# EAGLE design 3D-tracker (EAGLE 9.0.1)
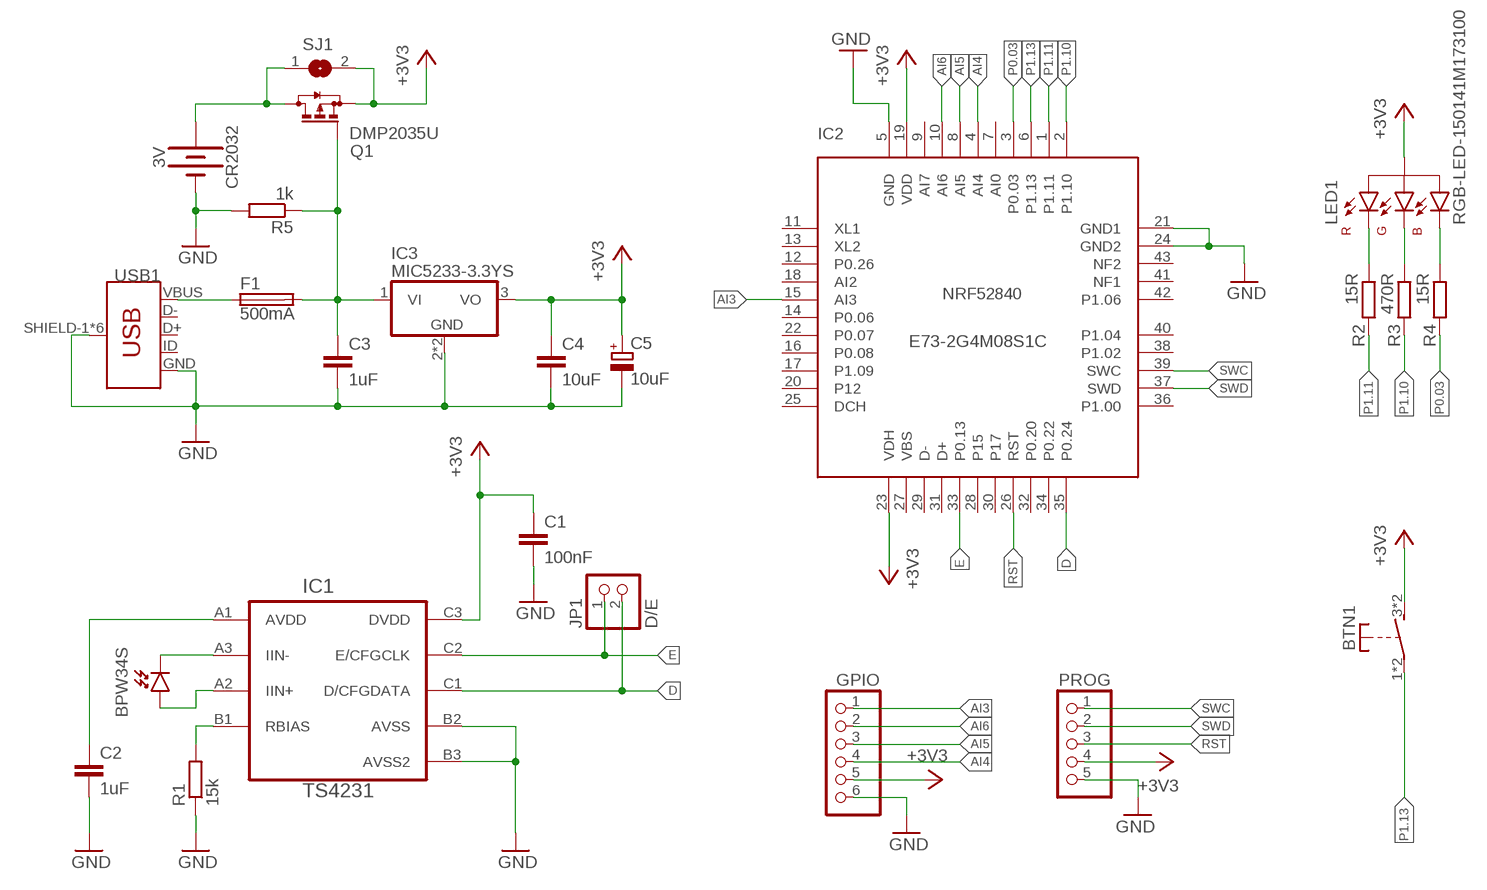
[diagram p0: schematic, sheet 1]

## Parts
BPW34S  JONNEW_PHOTODIODE_VBPW34S  [JONNEW_VBPW34S]
BTN1  SWITCH-SMD  [SWITCH-SMD]
C1  100nF  C-EUC0805  [C0805]
C2  1uF  C-EUC0805  [C0805]
C3  1uF  C-EUC0805  [C0805]
C4  10uF  C-EUC0805  [C0805]
C5  10uF  CPOL-EUE2-5  [E2-5]
CR2032  3V  CR2032-HOLDER  [BATTCON_20MM]
F1  500mA  FUSE-SMD  [R1206]
GPIO  PINHD-1X6  [1X06]
IC1  TS4231  JONNEW_TS4231  [JONNEW_WLCSP3X3]
IC2  NRF52840  E73-2G4M08S1C  [PE73(2G4M08S1C)]
IC3  MIC5233-3.3YS  MIC5233  [SOT223]
JP1  D/E  PINHD-1X2  [1X02]
LED1  RGB-LED-150141M173100  [LED4-3.5X2.8]
PROG  PINHD-1X5  [1X05]
Q1  DMP2035U  BSS84  [SOT23]
R1  15k  R-EU_R0805  [R0805]
R2  15R  R-EU_R0805  [R0805]
R3  470R  R-EU_R0805  [R0805]
R4  15R  R-EU_R0805  [R0805]
R5  1k  R-EU_R0805  [R0805]
SJ1  SJ  [SJ]
USB1  USB-B-MICRO-SMD  [MICRO-USB-B-SMD]

## Nets
+3V: CR2032.1(+) CR2032.3(+) Q1.3(D) SJ1.1
+3V3: BTN1.3(S) BTN1.4(S) C1.1 C4.1 C5.+ GPIO.5 IC1.C3(DVDD) IC2.19(VDD) IC2.23(VDH) IC3.3(VO) LED1.1(ALL-A) PROG.4 Q1.2(S) SJ1.2
+5V: C3.1 F1.2 IC3.1(VI) Q1.1(G) R5.1
AI3: GPIO.1 IC2.15(AI3)
AI4: GPIO.4 IC2.4(AI4)
AI5: GPIO.3 IC2.8(AI5)
AI6: GPIO.2 IC2.10(AI6)
AVDD: C2.1 IC1.A1(AVDD)
D: IC1.C1(D/CFGDATA) IC2.35(P0.24) JP1.2
E: IC1.C2(E/CFGCLK) IC2.33(P0.13) JP1.1
GND: C1.2 C2.2 C3.2 C4.2 C5.- CR2032.2(-) GPIO.6 IC1.B2(AVSS) IC1.B3(AVSS2) IC2.5(GND) IC2.21(GND1) IC2.24(GND2) IC3.2(GND) IC3.4(GND) PROG.5 R1.1 R5.2 USB1.GND USB1.SHIELD-1(SHIELD) USB1.SHIELD-2(SHIELD) USB1.SHIELD-3(SHIELD) USB1.SHIELD-4(SHIELD) USB1.SHIELD-5(SHIELD) USB1.SHIELD-6(SHIELD)
IIN+: BPW34S.A IC1.A2(IIN+)
IIN-: BPW34S.C IC1.A3(IIN-)
N$15: LED1.2(BLUE-C) R4.1
N$16: LED1.3(RED-C) R2.1
N$17: LED1.4(GREEN-C) R3.1
P0.03: IC2.3(P0.03) R4.2
P1.10: IC2.2(P1.10) R3.2
P1.11: IC2.1(P1.11) R2.2
P1.13: BTN1.1(P) BTN1.2(P) IC2.6(P1.13)
RBIAS: IC1.B1(RBIAS) R1.2
RST: IC2.26(RST) PROG.3
SWC: IC2.39(SWC) PROG.1
SWD: IC2.37(SWD) PROG.2
VBUS: F1.1 USB1.VBUS
Unconnected: IC2.7(AI0) IC2.9(AI7) IC2.11(XL1) IC2.12(P0.26) IC2.13(XL2) IC2.14(P0.06) IC2.16(P0.08) IC2.17(P1.09) IC2.18(AI2) IC2.20(P12) IC2.22(P0.07) IC2.25(DCH) IC2.27(VBS) IC2.28(P15) IC2.29(D-) IC2.30(P17) IC2.31(D+) IC2.32(P0.20) IC2.34(P0.22) IC2.36(P1.00) IC2.38(P1.02) IC2.40(P1.04) IC2.41(NF1) IC2.42(P1.06) IC2.43(NF2) USB1.D+ USB1.D- USB1.ID

## Notes on the sheet
- E73-2G4M08S1C

## Library data of the parts
BPW34S = ts4231-breakout-module:JONNEW_PHOTODIODE
BTN1 = Marw:SWITCH-SMD: KMR731NG LFS Taktilní Spínač - Farnell <https://cz.farnell.com/c-k-components/kmr731ng-lfs/tactile-sw-spst-no-0-05a-32vdc/dp/2845722>
C1-C4 = resistor:C-EU: CAPACITOR, European symbol
C5 = resistor:CPOL-EU: POLARIZED CAPACITOR, European symbol
CR2032 = Marw:CR2032-HOLDER
F1 = Marw:FUSE-SMD
GPIO = pinhead:PINHD-1X6: PIN HEADER
IC1 = ts4231-breakout-module:JONNEW_TS4231
IC2 = E73系列-PcbLib(1):E73-2G4M08S1C: nRF52840 Bluetooth 5.0 Module E73-2G4M08S1C Origin: http://www.ebyte.com/en/product-view-news.aspx?id=445
IC3 = Marw:MIC5233: High Input Voltage LDO Regulator Features Wide input voltage range: 2.3V to 36V Ultra-low ground current: 18μA Low dropout voltage of 270mV at 100mA Reverse-battery protection Reverse-leakage protection Thermal-shutdown and current-limit protection IttyBitty® SOT-23-5 and SOT-223-3 packages
JP1 = pinhead:PINHD-1X2: PIN HEADER
LED1 = Marw:RGB-LED-150141M173100: SMD RGB LED - 150141M173100 From: Farnell <https://cz.farnell.com/wurth-elektronik/150141m173100/led-1411-rgb-270mcd-950mcd-230mcd/dp/2322115> Producer: Wurth Elektronik Size: 3.5x2.8mm IF: R: 30mA, G: 30mA, B: 30mA UF: R: 2.0V, G: 3.2V, B: 3.2V
PROG = pinhead:PINHD-1X5: PIN HEADER
Q1 = transistor-small-signal:BSS84: P-CHANNEL MOS FET
R1-R5 = resistor:R-EU_: RESISTOR, European symbol
SJ1 = jumper:SJ: SMD solder JUMPER
USB1 = Marw:USB-B-MICRO-SMD: Micro USB Type B Connector Manufacturer: Molex Part number: 47346-0001 Link: Farnell <https://cz.farnell.com/molex/47346-0001/usb-conn-2-0-micro-usb-type-b/dp/1568026>

## Board
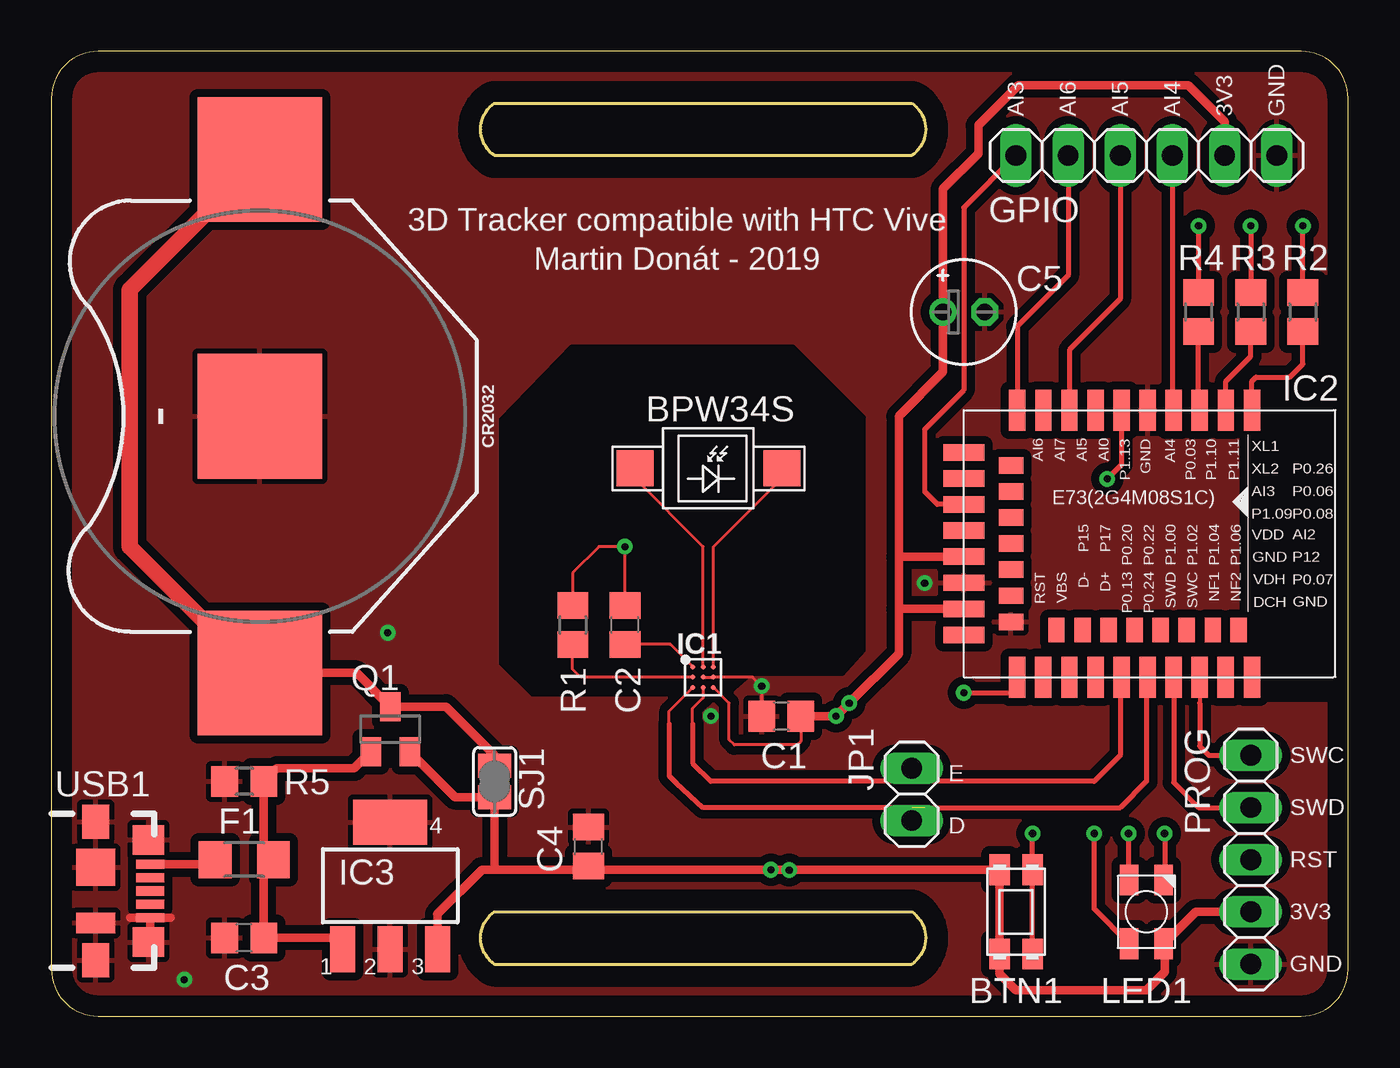
[diagram p1: board, top side]
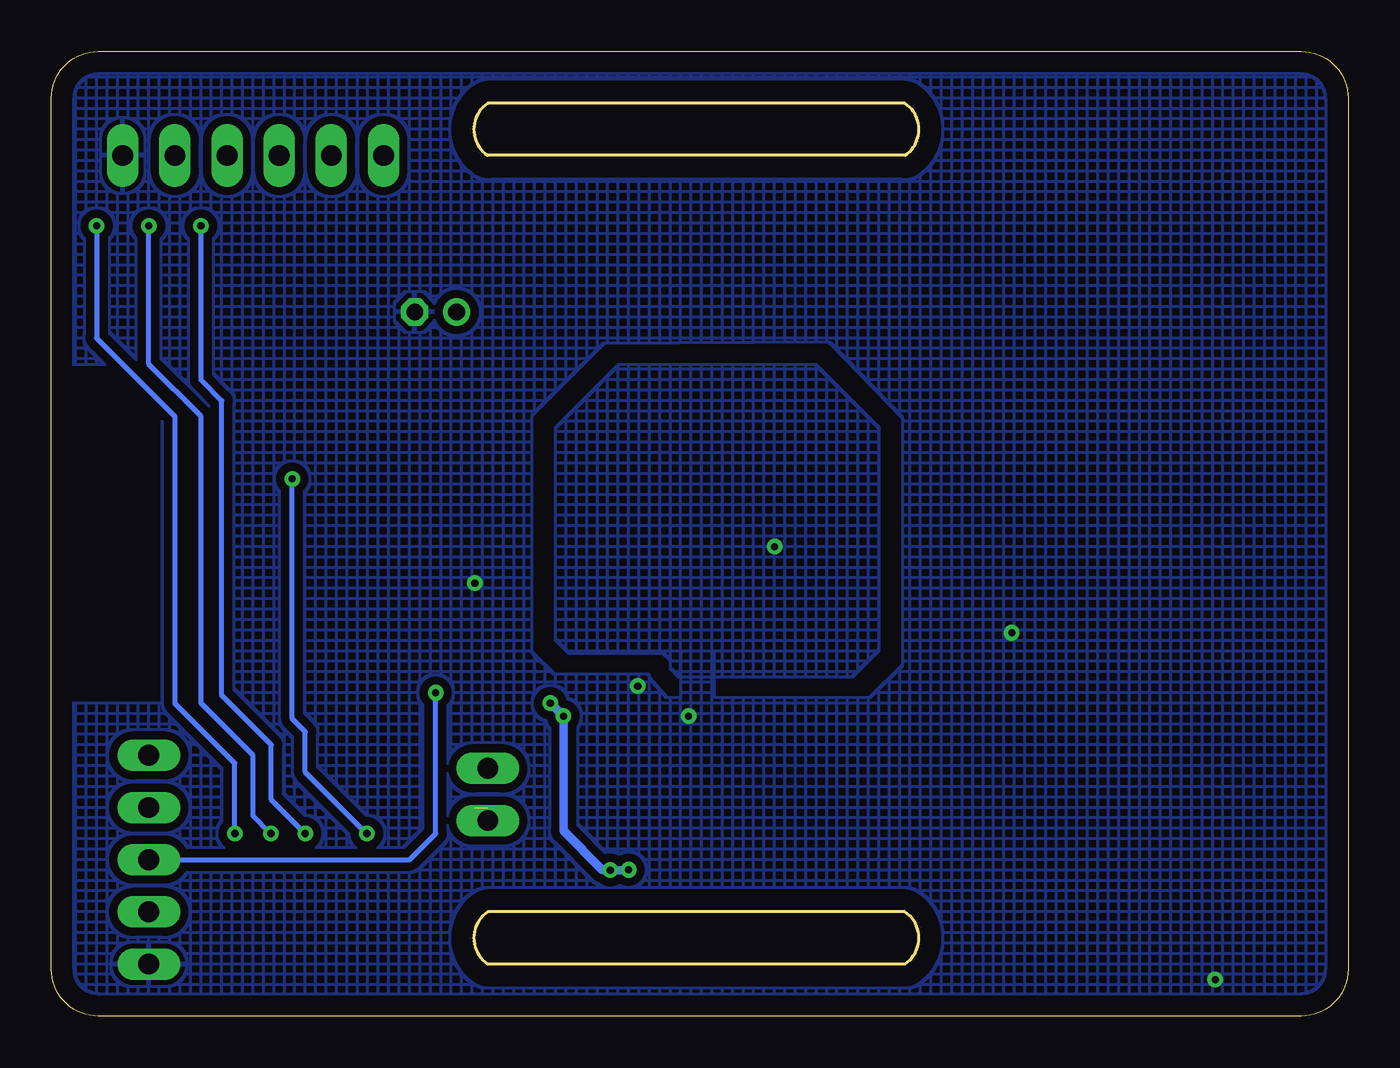
[diagram p2: board, bottom side, seen from below]

Size 63.17 x 46.98 mm. Coordinates in mm from the lower left corner, seen from the top.
Outline: 2.29,0 60.88,0 arc90 63.17,2.29 63.17,44.69 arc90 60.88,46.98 2.29,46.98 arc90 0,44.69 0,2.29 arc90 2.29,0
Outline: 21.59,44.45 41.91,44.45 arc-113 41.91,41.91 21.59,41.91 arc-113 21.59,44.45
Outline: 21.59,5.08 41.91,5.08 arc-113 41.91,2.54 21.59,2.54 arc-113 21.59,5.08
Copper layers (1*16): Top 0.035mm / dielectric 1.5mm / Bottom 0.035mm
Design rules "default": minimum track width 6mil, minimum drill 0.35mm, track to track 6mil, track to pad 6mil, pad to pad 6mil, via to via 6mil, smd to smd 6mil, copper to edge 40mil, drill to drill 6mil, minimum pad ring 10mil, minimum via ring 8mil, stop-mask expansion 4mil, vias tented up to drill 0mil, thermal gap 10mil

### Footprints (pad centres in the part's own frame; a part is rotated, then mirrored left to right if it is on the bottom)
JONNEW_VBPW34S = smd 1.8 x 1.75: A -3.575,0; C 3.575,0
SWITCH-SMD = smd 1.5 x 1: 1 -2.05,0.8; 2 2.05,0.8; 3 -2.05,-0.8; 4 2.05,-0.8
C0805 = smd 1.3 x 1.5: 1 -0.95,0; 2 0.95,0
E2-5 = drill 0.813 pad 1.27: + -1.016,0 | drill 0.813 pad 1.27 octagon: - 1.016,0
BATTCON_20MM = smd 6.07 x 6.07: 1 -12.5,0; 2 0,0; 3 12.5,0
R1206 = smd 1.6 x 1.803: 1 -1.422,0; 2 1.422,0
1X06 = drill 1.016 long: 1 -6.35,0; 2 -3.81,0; 3 -1.27,0; 4 1.27,0; 5 3.81,0; 6 6.35,0
JONNEW_WLCSP3X3 = smd 0.25 x 0.25: A1 -0.5,0.5; A2 0,0.5; A3 0.5,0.5; B1 -0.5,0; B2 0,0; B3 0.5,0; C1 -0.5,-0.5; C2 0,-0.5; C3 0.5,-0.5
PE73(2G4M08S1C) = smd 0.8 x 2: 1 14.03,13; 2 12.76,13; 3 11.49,13; 4 10.22,13; 5 8.95,13; 6 7.68,13; 7 6.41,13; 8 5.14,13; 9 3.873,13; 10 2.6,13; 26 2.6,0; 27 3.87,0; 29 5.14,0; 31 6.41,0; 33 7.68,0; 35 8.95,0; 37 10.22,0; 39 11.49,0; 41 12.757,0; 43 14.03,0 | smd 2 x 0.8: 11 0,10.945; 13 0,9.675; 15 0,8.405; 17 0,7.135; 19 0,5.865; 21 0,4.595; 23 0,3.325; 25 0,2.055 | smd 1.2 x 0.8: 12 2.3,10.31; 14 2.3,9.04; 16 2.3,7.77; 18 2.3,6.5; 20 2.3,5.23; 22 2.3,3.96; 24 2.3,2.69 | smd 0.8 x 1.2: 28 4.505,2.3; 30 5.775,2.3; 32 7.045,2.3; 34 8.315,2.3; 36 9.585,2.3; 38 10.855,2.3; 40 12.125,2.3; 42 13.39,2.3
SOT223 = smd 1.219 x 2.235: 1 -2.311,-3.099; 2 0,-3.099; 3 2.311,-3.099 | smd 3.6 x 2.2: 4 0,3.099
1X02 = drill 1.016 long: 1 -1.27,0; 2 1.27,0
LED4-3.5X2.8 = smd 1.5 x 0.9: 1 1.55,0.85; 2 1.55,-0.85; 3 -1.55,0.85; 4 -1.55,-0.85
1X05 = drill 1.016 long: 1 -5.08,0; 2 -2.54,0; 3 0,0; 4 2.54,0; 5 5.08,0
SOT23 = smd 1 x 1.4: 1 -0.95,-1.1; 2 0.95,-1.1; 3 0,1.1
R0805 = smd 1.3 x 1.5: 1 -0.95,0; 2 0.95,0
SJ = smd 1.168 x 1.6: 1 -0.762,0; 2 0.762,0
MICRO-USB-B-SMD = smd 0.45 x 1.38: D+ 0,2.66; D- -0.65,2.66; GND 1.3,2.66; ID 0.65,2.66; VBUS -1.3,2.66 | smd 1.425 x 1.55: SHIELD-1 -2.487,2.575; SHIELD-2 2.487,2.575 | smd 1.65 x 1.3: SHIELD-3 -3.375,0; SHIELD-6 3.375,0 | smd 1.8 x 1.9: SHIELD-4 -1.15,0 | smd 1 x 1.9: SHIELD-5 1.55,0

### Placement (x,y rotation side)
BPW34S  32,26.67 0 top
BTN1  46.99,5.08 270 top
C1  35.56,14.61 180 top
C2  27.94,19.05 90 top
C3  9.4,3.81 180 top
C4  26.16,8.26 90 top
C5  44.45,34.29 0 top
CR2032  10.16,29.21 90 top
F1  9.4,7.62 0 top
GPIO  53.34,41.91 0 top
IC1  31.75,16.51 0 top
IC2  44.45,16.51 0 top
IC3  16.51,6.35 0 top
JP1  41.91,10.79 270 top
LED1  53.34,5.08 270 top
PROG  58.42,7.62 270 top
Q1  16.51,13.97 0 top
R1  25.4,19.05 270 top
R2  60.96,34.29 270 top
R3  58.42,34.29 270 top
R4  55.88,34.29 270 top
R5  9.4,11.43 180 top
SJ1  21.59,11.43 270 top
USB1  2.16,6.1 270 top

### Tracks (layer width: path | path; a pad name or v marks a point on that pad's centre or on a via)
+3V
  Top 0.406: 9.96,16.71 CR2032.1 14.87,16.71 Q1.3 19.22,15.07 21.59,12.7 SJ1.1
  Top 0.813: CR2032.3 3.81,35.36 3.81,22.86 9.96,16.71
+3V3  (via drill 0.35)
  Top 0.152: IC1.C3 33.02,15.24 33.02,13.46 33.27,13.21 36.32,13.21 36.51,13.4 C1.1
  Top 0.406: GPIO.5 57.15,43.56 55.37,45.34 47.12,45.34 45.16,43.38 45.16,42 43.43,40.28 C5.+ 43.43,31.37 41.27,29.21 41.27,22.35 | 44.43,22.35 IC2.19 41.55,22.38 41.27,22.35 | 41.27,22.35 41.27,19.84 | PROG.4 55.74,5.08 LED1.1 54.23,3.49 54.23,2.16 53.34,1.27 46.99,1.27 46.19,2.07 BTN1.4 BTN1.3 v35.05,7.13 26.67,7.13 | 26.67,7.13 21.59,7.13 | 21.59,7.13 20.97,7.13 18.8,4.95 18.82,4.93 IC3.3 | IC2.23 41.27,19.84 | Q1.2 19.66,10.67 SJ1.2 21.59,7.13 | C4.1 26.5,7.3 26.67,7.13 | 41.27,19.84 41.27,17.65 v38.86,15.24 v38.23,14.61 C1.1
  Bottom 0.406: v35.05,7.13 35.07,7.11 v35.94,7.11 36.32,7.11 38.23,9.02 v38.23,14.61 v38.86,15.24
+5V
  Top 0.406: Q1.1 14.76,12.06 10.98,12.06 R5.1 10.35,8.09 F1.2 10.35,7.15 C3.1 13.64,3.81 IC3.1
AI3
  Top 0.254: GPIO.1 44.45,39.37 44.45,30.48 42.55,28.57 42.55,25.53 43.16,24.91 IC2.15
AI4
  Top 0.203: 54.61,29.57 IC2.4
  Top 0.254: GPIO.4 54.61,29.57
AI5
  Top 0.254: GPIO.3 52.07,34.92 49.59,32.45 IC2.8
AI6
  Top 0.254: GPIO.2 49.53,36.07 47.05,33.59 IC2.10
AVDD
  Top 0.152: IC1.A1 30.16,18.1 C2.1
D  (1 unrouted)
  Top 0.152: IC1.C1 30.1,14.86 30.1,13.97
  Top 0.254: 42.55,10.16 31.75,10.16 30.43,11.38 | 30.43,11.38 30.1,11.68 | JP1.2 41.91,10.16 52.07,10.16 53.34,11.43 53.34,16.45 IC2.35 | 30.43,11.38 30.1,11.71 30.1,13.97 30.1,14.22
E
  Top 0.152: IC1.C2 31.75,15.49 31.24,14.99 31.24,13.97
  Top 0.254: 41.91,11.43 32.13,11.43 31.24,12.32 31.24,13.97 31.24,14.22 | JP1.1 41.91,11.43 | IC2.33 52.07,16.45 52.07,12.7 50.8,11.43 41.91,11.43
GND  (via drill 0.35)
  Top 0.152: C2.2 v27.94,22.86 26.67,22.86 25.4,21.59 R1.1 | IC1.B2 IC1.B3 34.16,16.51 v34.61,16.06 C1.2 | 4.82,3.69 USB1.SHIELD-2
  Top 0.406: USB1.GND 4.82,3.69 | USB1.GND 5.81,4.8 | USB1.GND 3.84,4.8
  other vias: 32.13,14.61 42.55,21.08 6.48,1.78 16.38,18.67
  pour Bottom (isolate 0.813, hatched): 35.56,31.75 25.91,31.75 22.86,28.7 22.86,17.78 24.13,16.51 32.64,16.51 33.02,16.89 33.02,17.27 33.4,17.65 37.97,17.65 38.61,18.29 38.61,28.7
  pour Bottom (isolate 0.406, hatched): 0,33.02 0,44.7 arc-90 2.29,46.99 60.96,46.99 arc-90 63.25,44.7 63.25,31.75 57.78,31.75 57.78,15.24 63.25,15.24 63.25,2.29 arc-90 60.96,0 2.29,0 arc-90 0,2.29 0,32.89 25.27,32.77 21.72,29.08 21.72,17.14 23.37,15.49 30.86,15.49 30.86,17.78 32.51,17.78 32.51,15.49 33.15,15.49 34.04,16.51 34.04,16.64 38.61,16.64 39.75,17.78 39.75,29.21 36.2,32.77
  pour Top (isolate 0.406): 40.01,46.99 60.96,46.99 arc-90 63.25,44.7 63.25,31.75 57.78,31.75 57.78,15.24 63.25,15.24 63.25,2.29 arc-90 60.96,0 2.29,0 arc-90 0,2.29 0,44.7 arc-90 2.29,46.99 39.88,46.99 39.75,32.38 39.75,29.21 36.2,32.77 25.27,32.77 21.72,29.08 21.72,17.14 23.37,15.49 33.02,15.49 34.16,16.51 38.61,16.51 39.75,17.78 39.75,29.08 39.88,29.34 39.88,32.38
IIN+
  Top 0.152: IC1.A2 31.75,22.86 28.43,26.18 BPW34S.A
IIN-
  Top 0.152: IC1.A3 32.25,22.85 35.58,26.18 BPW34S.C
N$15  (via drill 0.35)
  Top 0.254: LED1.2 50.8,5.22 v50.8,8.89 50.8,9.02 | v55.88,38.48 R4.1
  Bottom 0.254: v50.8,8.89 52.45,10.54 52.45,13.21 54.86,15.62 54.86,29.97 55.88,30.99 v55.88,38.48
N$16  (via drill 0.35)
  Top 0.254: R2.1 v60.96,38.48 | v54.23,8.89 54.23,6.67 LED1.3
  Bottom 0.254: v60.96,38.48 60.96,33.02 57.15,29.21 57.15,15.24 54.23,12.32 v54.23,8.89
N$17  (via drill 0.35)
  Top 0.254: v58.42,38.48 R3.1 | LED1.4 52.49,8.88 v52.48,8.89
  Bottom 0.254: v52.48,8.89 53.34,9.75 53.34,12.7 55.88,15.24 55.88,29.21 58.42,31.75 v58.42,38.48
P0.03
  Top 0.203: IC2.3 55.88,29.57
  Top 0.254: 55.88,29.57 R4.2
P1.10
  Top 0.254: IC2.2 57.21,30.92 58.42,32.13 R3.2
P1.11
  Top 0.254: IC2.1 58.48,30.92 58.67,31.11 60.33,31.11 60.96,31.75 R2.2
P1.13  (via drill 0.35)
  Top 0.254: BTN1.2 BTN1.1 47.79,8.88 v47.8,8.89 | IC2.6 52.13,26.86 v51.44,26.16
  Bottom 0.254: v47.8,8.89 50.8,11.89 50.8,13.84 51.44,14.48 v51.44,26.16
RBIAS
  Top 0.152: IC1.B1 25.78,16.51 25.4,16.89 R1.2
RST  (via drill 0.35)
  Top 0.254: v44.45,15.75 47.05,15.75 IC2.26
  Bottom 0.254: PROG.3 45.72,7.62 44.45,8.89 v44.45,15.75
SWC
  Top 0.203: IC2.39 55.94,15.24 | 55.94,15.24
  Top 0.254: 55.94,15.24 55.94,13.15 56.39,12.7 PROG.1
SWD
  Top 0.254: IC2.37 54.67,11.37 55.88,10.16 PROG.2
VBUS
  Top 0.406: USB1.VBUS 7.75,7.4 F1.1

### Text on the board
tPlace: 3D Tracker compatible with HTC Vive | Martin Donát - 2019
tNames: AI3 | AI6 | AI5 | AI4 | 3V3 | GND | - | SWC | E | SWD | D | RST | 3V3 | GND